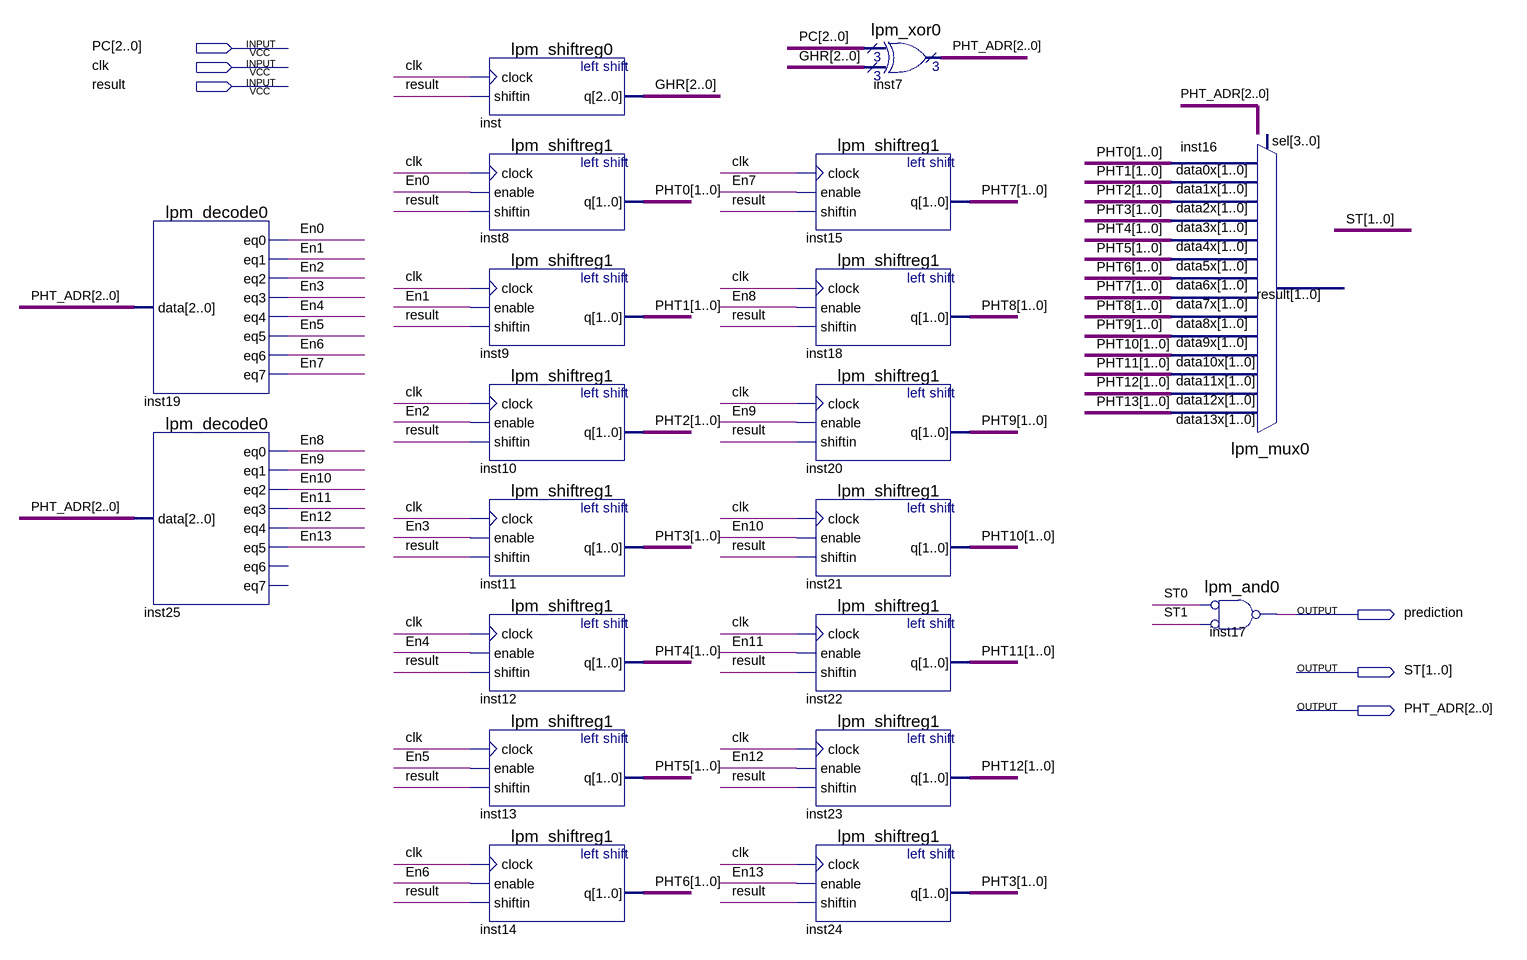
[diagram p0: schematic sheet]
// Quartus schematic Predictor.bdf as structural Verilog: 20 symbols, 6 pins
module Predictor (
  input  [2:0] PC,
  input  clk,
  input  result,
  output prediction,
  output [1:0] ST,
  output [2:0] PHT_ADR
);

  wire En0, En1, En2, En3, En4, En5, En6, En7, En8, En9, En10, En11, En12, En13, inst17_result;
  wire [1:0] PHT0, PHT1, PHT2, PHT3, PHT4, PHT5, PHT6, PHT7, PHT8, PHT9, PHT10, PHT11, PHT12, PHT13;
  wire [2:0] GHR;

  lpm_decode0 inst19 (
    .data(PHT_ADR), .eq0(En0), .eq1(En1), .eq2(En2), .eq3(En3), .eq4(En4), .eq5(En5), .eq6(En6), .eq7(En7));
  lpm_decode0 inst25 (
    .data(PHT_ADR), .eq0(En8), .eq1(En9), .eq2(En10), .eq3(En11), .eq4(En12), .eq5(En13));  // open: eq6, eq7
  lpm_shiftreg0 inst (.clock(clk), .shiftin(result), .q(GHR));
  lpm_shiftreg1 inst8 (.clock(clk), .enable(En0), .shiftin(result), .q(PHT0));
  lpm_shiftreg1 inst9 (.clock(clk), .enable(En1), .shiftin(result), .q(PHT1));
  lpm_shiftreg1 inst10 (.clock(clk), .enable(En2), .shiftin(result), .q(PHT2));
  lpm_shiftreg1 inst11 (.clock(clk), .enable(En3), .shiftin(result), .q(PHT3));
  lpm_shiftreg1 inst12 (.clock(clk), .enable(En4), .shiftin(result), .q(PHT4));
  lpm_shiftreg1 inst13 (.clock(clk), .enable(En5), .shiftin(result), .q(PHT5));
  lpm_shiftreg1 inst14 (.clock(clk), .enable(En6), .shiftin(result), .q(PHT6));
  lpm_shiftreg1 inst15 (.clock(clk), .enable(En7), .shiftin(result), .q(PHT7));
  lpm_shiftreg1 inst18 (.clock(clk), .enable(En8), .shiftin(result), .q(PHT8));
  lpm_shiftreg1 inst20 (.clock(clk), .enable(En9), .shiftin(result), .q(PHT9));
  lpm_shiftreg1 inst21 (.clock(clk), .enable(En10), .shiftin(result), .q(PHT10));
  lpm_shiftreg1 inst22 (.clock(clk), .enable(En11), .shiftin(result), .q(PHT11));
  lpm_shiftreg1 inst23 (.clock(clk), .enable(En12), .shiftin(result), .q(PHT12));
  lpm_shiftreg1 inst24 (.clock(clk), .enable(En13), .shiftin(result), .q(PHT3));
  lpm_xor0 inst7 (.data0x(PC), .data1x(GHR), .result(PHT_ADR));
  lpm_mux0 inst16 (
    .data13x(PHT13), .data12x(PHT12), .data11x(PHT11), .data10x(PHT10), .data9x(PHT9), .data8x(PHT8),
    .data7x(PHT7), .data6x(PHT6), .data5x(PHT5), .data4x(PHT4), .data3x(PHT3), .data2x(PHT2), .data1x(PHT1),
    .data0x(PHT0));  // open: sel, result
  lpm_and0 inst17 (.data0(~ST[0]), .data1(~ST[1]), .result(inst17_result));
  not inst17_result_inverted (prediction, inst17_result);
endmodule
